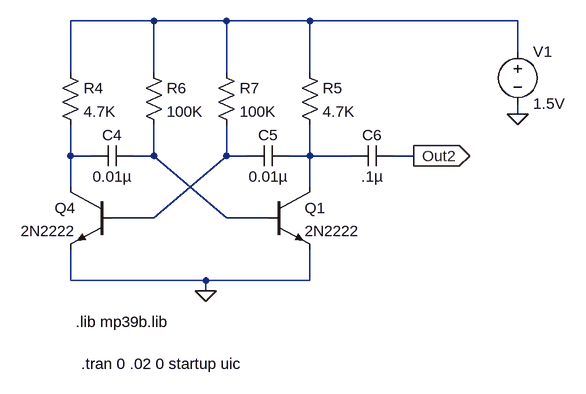
[diagram p0: schematic Tester-npn.asc]
Tester-npn.asc, the LTspice schematic file:
Version 4
SHEET 1 1544 680
WIRE 752 -512 624 -512
WIRE 864 -512 752 -512
WIRE 992 -512 864 -512
WIRE 1312 -512 992 -512
WIRE 1312 -464 1312 -512
WIRE 624 -432 624 -512
WIRE 752 -432 752 -512
WIRE 864 -432 864 -512
WIRE 992 -432 992 -512
WIRE 1312 -368 1312 -384
WIRE 624 -304 624 -352
WIRE 656 -304 624 -304
WIRE 752 -304 752 -352
WIRE 752 -304 720 -304
WIRE 864 -304 864 -352
WIRE 896 -304 864 -304
WIRE 992 -304 992 -352
WIRE 992 -304 960 -304
WIRE 1056 -304 992 -304
WIRE 1152 -304 1120 -304
WIRE 624 -256 624 -304
WIRE 992 -256 992 -304
WIRE 752 -208 864 -304
WIRE 752 -208 688 -208
WIRE 864 -208 752 -304
WIRE 928 -208 864 -208
WIRE 624 -112 624 -160
WIRE 832 -112 624 -112
WIRE 992 -112 992 -160
WIRE 992 -112 832 -112
WIRE 832 -96 832 -112
FLAG 832 -96 0
FLAG 1312 -368 0
FLAG 1152 -304 Out2
IOPIN 1152 -304 Out
SYMBOL res 608 -448 R0
SYMATTR InstName R4
SYMATTR Value 4.7K
SYMBOL voltage 1312 -480 R0
WINDOW 123 0 0 Left 2
WINDOW 39 24 -12 Left 2
SYMATTR InstName V1
SYMATTR Value 1.5V
SYMBOL res 976 -448 R0
SYMATTR InstName R5
SYMATTR Value 4.7K
SYMBOL res 736 -448 R0
SYMATTR InstName R6
SYMATTR Value 100K
SYMBOL res 848 -448 R0
SYMATTR InstName R7
SYMATTR Value 100K
SYMBOL cap 720 -320 R90
WINDOW 0 0 32 VBottom 2
WINDOW 3 32 32 VTop 2
SYMATTR InstName C4
SYMATTR Value 0.01µ
SYMBOL cap 960 -320 R90
WINDOW 0 0 32 VBottom 2
WINDOW 3 32 32 VTop 2
SYMATTR InstName C5
SYMATTR Value 0.01µ
SYMBOL cap 1120 -320 R90
WINDOW 0 0 32 VBottom 2
WINDOW 3 32 32 VTop 2
SYMATTR InstName C6
SYMATTR Value .1µ
SYMBOL npn 928 -256 R0
SYMATTR InstName Q1
SYMATTR Value 2N2222
SYMBOL npn 688 -256 M0
SYMATTR InstName Q4
SYMATTR Value 2N2222
TEXT 632 -48 Left 2 !.lib mp39b.lib
TEXT 640 16 Left 2 !.tran 0 .02 0 startup uic

The netlist it stands for:
* Tester-npn.asc
R4 N001 N002 4.7K
V1 N001 0 1.5V
R5 N001 N005 4.7K
R6 N001 N003 100K
R7 N001 N004 100K
C4 N003 N002 0.01µ
C5 N005 N004 0.01µ
C6 Out2 N005 .1µ
Q1 N005 N003 0 0 2N2222
Q4 N002 N004 0 0 2N2222
.model NPN NPN
.model PNP PNP
.lib standard.bjt
.lib mp39b.lib
.tran 0 .02 0 startup uic
.backanno
.end